# EAGLE design xbee_pro_sx_breakout_1 (EAGLE 9.6.2)
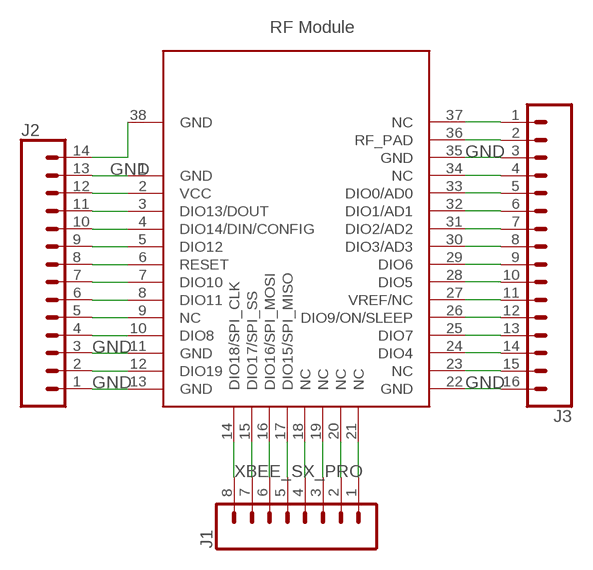
[diagram p0: schematic, sheet 1]

## Parts
J1  CONN_08"  [1X08]
J2  CONN_14  [1X14]
J3  CONN_16  [1X16]
U$1  XBEE_SX_PRO  [XBEE_SX_PRO]

## Nets
GND: J2.1 J2.3 J2.13 J2.14 J3.3 J3.16 U$1.1(GND) U$1.11(GND) U$1.13(GND) U$1.22(GND) U$1.35(GND) U$1.38(GND)
N$1: J3.1 U$1.37(NC)
N$2: J3.2 U$1.36(RF_PAD)
N$4: J3.4 U$1.34(NC)
N$5: J3.5 U$1.33(DIO0/AD0)
N$6: J3.6 U$1.32(DIO1/AD1)
N$7: J3.7 U$1.31(DIO2/AD2)
N$8: J3.8 U$1.30(DIO3/AD3)
N$9: J3.9 U$1.29(DIO6)
N$10: J3.10 U$1.28(DIO5)
N$11: J3.11 U$1.27(VREF/NC)
N$12: J3.12 U$1.26(DIO9/ON/SLEEP)
N$13: J3.13 U$1.25(DIO7)
N$14: J3.14 U$1.24(DIO4)
N$15: J3.15 U$1.23(NC)
N$17: J1.1 U$1.21(NC)
N$18: J1.2 U$1.20(NC)
N$19: J1.3 U$1.19(NC)
N$20: J1.4 U$1.18(NC)
N$21: J1.5 U$1.17(DIO15/SPI_MISO)
N$22: J1.6 U$1.16(DIO16/SPI_MOSI)
N$23: J1.7 U$1.15(DIO17/SPI_SS)
N$24: J1.8 U$1.14(DIO18/SPI_CLK)
N$26: J2.2 U$1.12(DIO19)
N$28: J2.4 U$1.10(DIO8)
N$29: J2.5 U$1.9(NC)
N$30: J2.6 U$1.8(DIO11)
N$31: J2.7 U$1.7(DIO10)
N$32: J2.8 U$1.6(RESET)
N$33: J2.9 U$1.5(DIO12)
N$34: J2.10 U$1.4(DIO14/DIN/CONFIG)
N$35: J2.11 U$1.3(DIO13/DOUT)
VCC: J2.12 U$1.2(VCC)

## Library data of the parts
J1 = SparkFun-Connectors:CONN_08: Multi connection point. Often used as Generic Header-pin footprint for 0.1 inch spaced/style header connections On any of the 0.1 inch spaced packages, you can populate with these: Break Away Headers - Straight <https://www.sparkfun.com/products/116> (PRT-00116) Break Away Male Headers - Right Angle <https://www.sparkfun.com/products/553> (PRT-00553) Female Headers <https://www.sparkfun.com/products/115> (PRT-00115) Break Away Headers - Machine Pin <https://www.sparkfun.com/products/117> (PRT-00117) Break Away Female Headers - Swiss Machine Pin <https://www.sparkfun.com/products/743> (PRT-00743) Arduino Stackable Header - 8 Pin <https://www.sparkfun.com/products/9279> (PRT-09279) For SCREWTERMINALS and SPRING TERMINALS visit here: Screw Terimnals on SparkFun.com <https://www.sparkfun.com/search/results?term=Screw+Terminals> (5mm/3.5mm/2.54mm spacing) This device is also useful as a general connection point to wire up your design to another part of your project. Our various solder wires solder well into these plated through hole pads. Hook-Up Wire - Assortment (Stranded, 22 AWG) <https://www.sparkfun.com/products/11375> (PRT-11375) Hook-Up Wire - Assortment (Solid Core, 22 AWG) <https://www.sparkfun.com/products/11367> (PRT-11367) View the entire wire category on our website here <https://www.sparkfun.com/categories/141> Special notes: Molex polarized connector foot print use with SKU : PRT-08231 with associated crimp pins and housings. 1MM SMD Version SKU: PRT-10208 NOTES ON THE VARIANTS LOCK and LOCK_LONGPADS... This footprint was designed to help hold the alignment of a through-hole component (i.e. 6-pin header) while soldering it into place. You may notice that each hole has been shifted either up or down by 0.005 of an inch from it's more standard position (which is a perfectly straight line). This slight alteration caused the pins (the squares in the middle) to touch the edges of the holes. Because they are alternating, it causes a "brace" to hold the component in place. 0.005 has proven to be the perfect amount of "off-center" position when using our standard breakaway headers. Although looks a little odd when you look at the bare footprint, once you have a header in there, the alteration is very hard to notice. Also,if you push a header all the way into place, it is covered up entirely on the bottom side.; PROD_ID: CONN-08438
J2 = SparkFun-Connectors:CONN_14: Multi connection point. Often used as Generic Header-pin footprint for 0.1 inch spaced/style header connections On any of the 0.1 inch spaced packages, you can populate with these: Break Away Headers - Straight <https://www.sparkfun.com/products/116> (PRT-00116) Break Away Male Headers - Right Angle <https://www.sparkfun.com/products/553> (PRT-00553) Female Headers <https://www.sparkfun.com/products/115> (PRT-00115) Break Away Headers - Machine Pin <https://www.sparkfun.com/products/117> (PRT-00117) Break Away Female Headers - Swiss Machine Pin <https://www.sparkfun.com/products/743> (PRT-00743) For SCREWTERMINALS and SPRING TERMINALS visit here: Screw Terimnals on SparkFun.com <https://www.sparkfun.com/search/results?term=Screw+Terminals> (5mm/3.5mm/2.54mm spacing) This device is also useful as a general connection point to wire up your design to another part of your project. Our various solder wires solder well into these plated through hole pads. Hook-Up Wire - Assortment (Stranded, 22 AWG) <https://www.sparkfun.com/products/11375> (PRT-11375) Hook-Up Wire - Assortment (Solid Core, 22 AWG) <https://www.sparkfun.com/products/11367> (PRT-11367) View the entire wire category on our website here <https://www.sparkfun.com/categories/141> Special notes: Molex polarized connector foot print use with SKU : PRT-08231 with associated crimp pins and housings. 1MM SMD Version SKU: PRT-10208 NOTES ON THE VARIANTS LOCK and LOCK_LONGPADS... This footprint was designed to help hold the alignment of a through-hole component (i.e. 6-pin header) while soldering it into place. You may notice that each hole has been shifted either up or down by 0.005 of an inch from it's more standard position (which is a perfectly straight line). This slight alteration caused the pins (the squares in the middle) to touch the edges of the holes. Because they are alternating, it causes a "brace" to hold the component in place. 0.005 has proven to be the perfect amount of "off-center" position when using our standard breakaway headers. Although looks a little odd when you look at the bare footprint, once you have a header in there, the alteration is very hard to notice. Also,if you push a header all the way into place, it is covered up entirely on the bottom side.
J3 = SparkFun-Connectors:CONN_16: Multi connection point. Often used as Generic Header-pin footprint for 0.1 inch spaced/style header connections On any of the 0.1 inch spaced packages, you can populate with these: Break Away Headers - Straight <https://www.sparkfun.com/products/116> (PRT-00116) Break Away Male Headers - Right Angle <https://www.sparkfun.com/products/553> (PRT-00553) Female Headers <https://www.sparkfun.com/products/115> (PRT-00115) Break Away Headers - Machine Pin <https://www.sparkfun.com/products/117> (PRT-00117) Break Away Female Headers - Swiss Machine Pin <https://www.sparkfun.com/products/743> (PRT-00743) For SCREWTERMINALS and SPRING TERMINALS visit here: Screw Terimnals on SparkFun.com <https://www.sparkfun.com/search/results?term=Screw+Terminals> (5mm/3.5mm/2.54mm spacing) This device is also useful as a general connection point to wire up your design to another part of your project. Our various solder wires solder well into these plated through hole pads. Hook-Up Wire - Assortment (Stranded, 22 AWG) <https://www.sparkfun.com/products/11375> (PRT-11375) Hook-Up Wire - Assortment (Solid Core, 22 AWG) <https://www.sparkfun.com/products/11367> (PRT-11367) View the entire wire category on our website here <https://www.sparkfun.com/categories/141> Special notes: Molex polarized connector foot print use with SKU : PRT-08231 with associated crimp pins and housings. 1MM SMD Version SKU: PRT-10208 NOTES ON THE VARIANTS LOCK and LOCK_LONGPADS... This footprint was designed to help hold the alignment of a through-hole component (i.e. 6-pin header) while soldering it into place. You may notice that each hole has been shifted either up or down by 0.005 of an inch from it's more standard position (which is a perfectly straight line). This slight alteration caused the pins (the squares in the middle) to touch the edges of the holes. Because they are alternating, it causes a "brace" to hold the component in place. 0.005 has proven to be the perfect amount of "off-center" position when using our standard breakaway headers. Although looks a little odd when you look at the bare footprint, once you have a header in there, the alteration is very hard to notice. Also,if you push a header all the way into place, it is covered up entirely on the bottom side.
U$1 = xbee_sx_pro:XBEE_SX_PRO

## Module BREAKOUT
Ports: 

### Library data of the parts

## Board
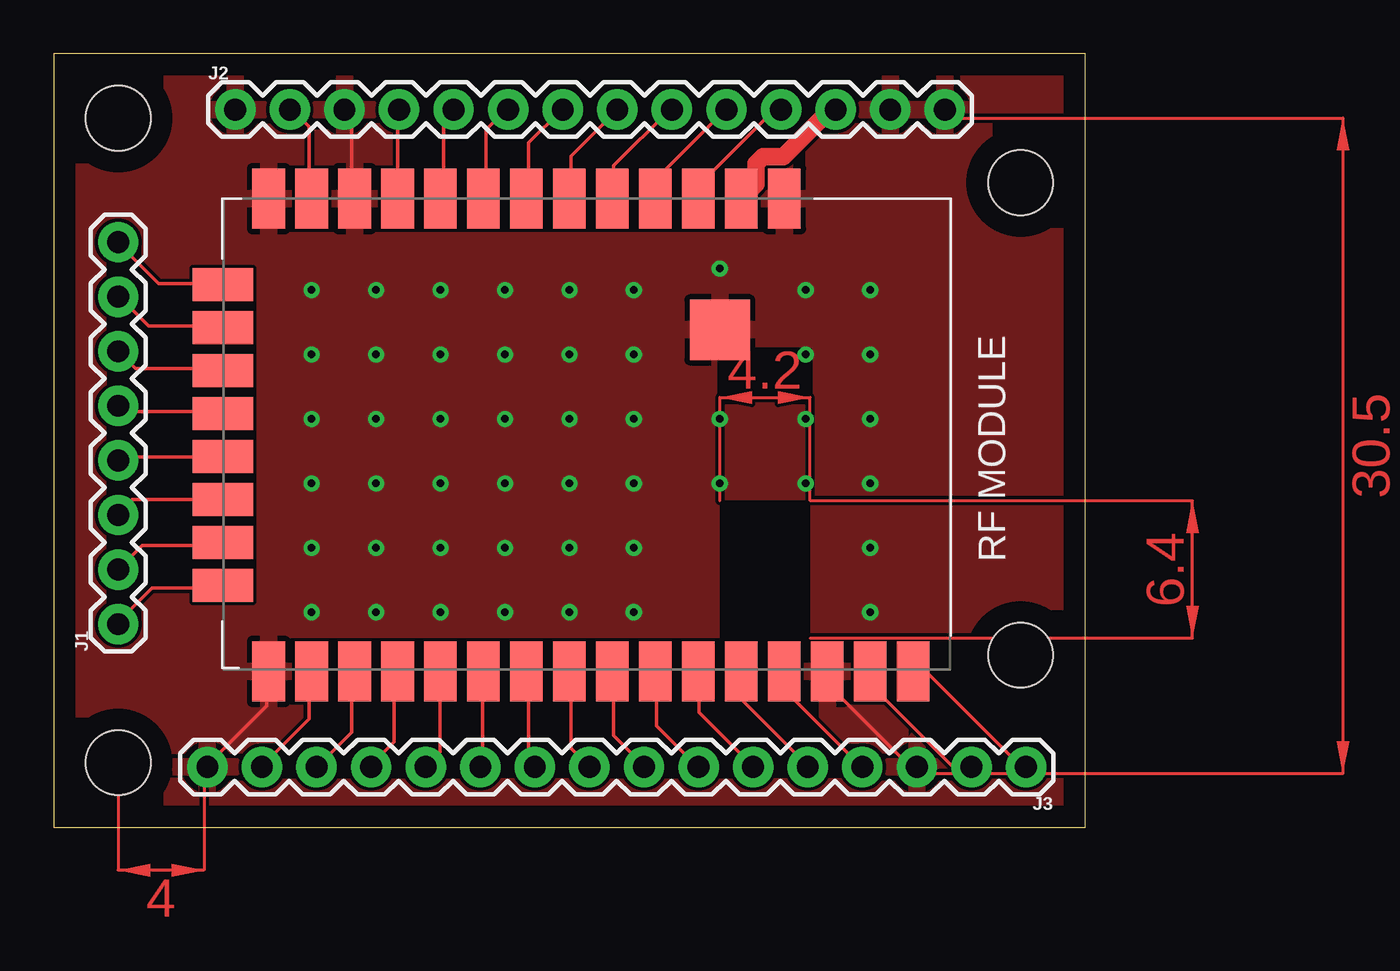
[diagram p1: board, top side]
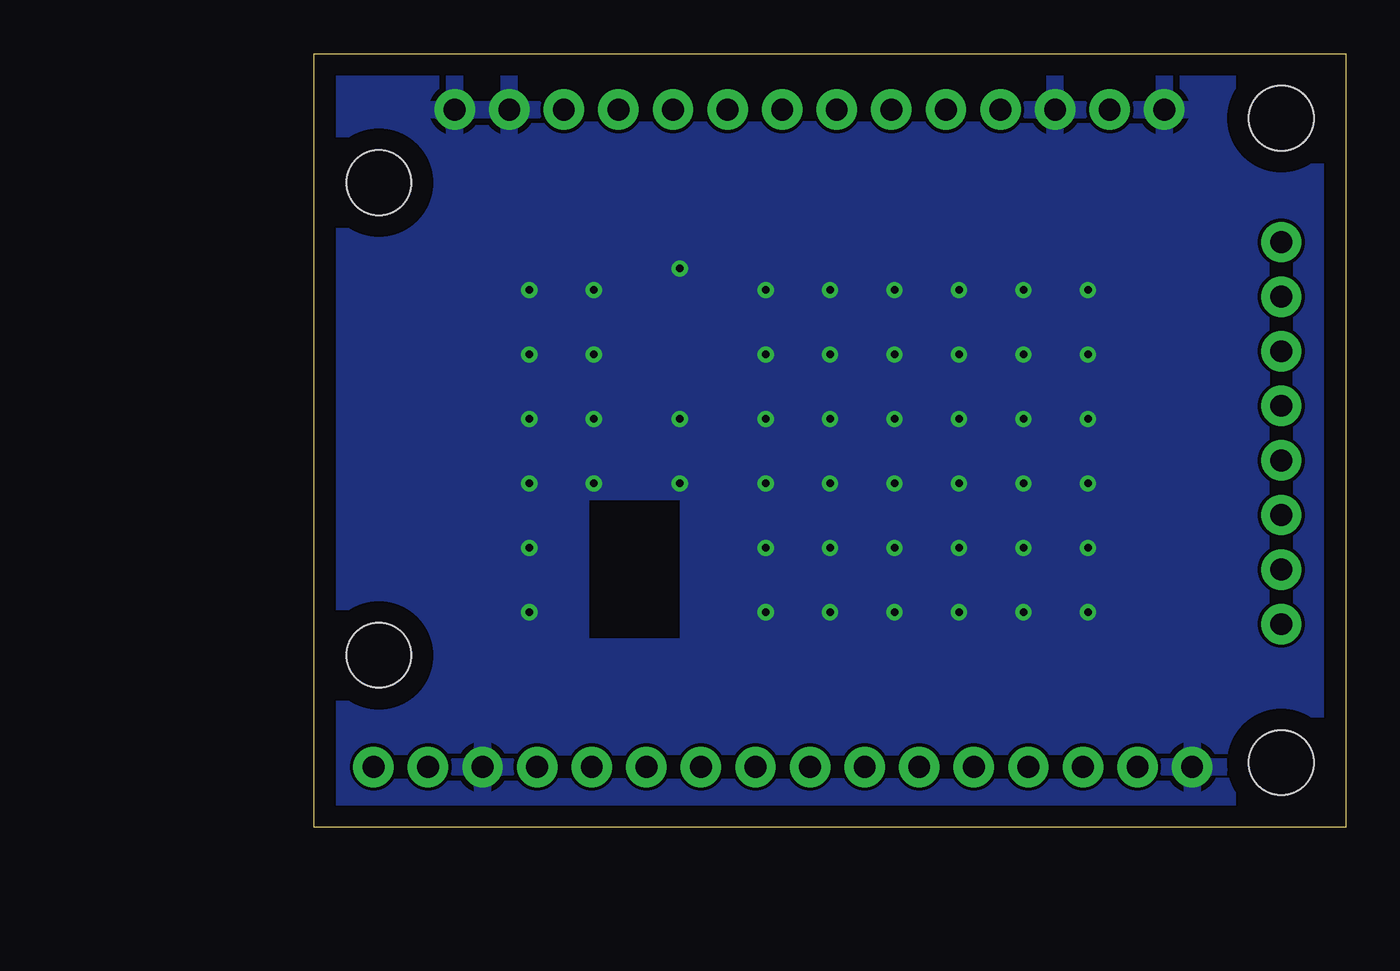
[diagram p2: board, bottom side, seen from below]

Size 48 x 36 mm. Coordinates in mm from the lower left corner, seen from the top.
Outline: 0,0 48,0 48,36 0,36 0,0
Copper layers (1*16): Top 0.035mm / dielectric 1.5mm / Bottom 0.035mm
Design rules "default": minimum track width 6mil, minimum drill 0.35mm, track to track 6mil, track to pad 6mil, pad to pad 6mil, via to via 6mil, smd to smd 6mil, copper to edge 40mil, drill to drill 6mil, minimum pad ring 10mil, minimum via ring 8mil, stop-mask expansion 4mil, vias tented up to drill 0mil, thermal gap 10mil
Holes 3 mm at 3,33 3,3 45,30 45,8
tKeepout: area 31,8.8 to 35.2,15.2
bKeepout: area 31,8.8 to 35.2,15.2
tRestrict: area 31,8.8 to 35.2,15.2
bRestrict: area 31,8.8 to 35.2,15.2

### Footprints (pad centres in the part's own frame; a part is rotated, then mirrored left to right if it is on the bottom)
1X08 = drill 1.016 pad 1.88: 1 0,0; 2 2.54,0; 3 5.08,0; 4 7.62,0; 5 10.16,0; 6 12.7,0; 7 15.24,0; 8 17.78,0
1X14 = drill 1.016 pad 1.88: 1 0,0; 2 2.54,0; 3 5.08,0; 4 7.62,0; 5 10.16,0; 6 12.7,0; 7 15.24,0; 8 17.78,0; 9 20.32,0; 10 22.86,0; 11 25.4,0; 12 27.94,0; 13 30.48,0; 14 33.02,0
1X16 = drill 1.016 pad 1.88: 1 0,0; 2 2.54,0; 3 5.08,0; 4 7.62,0; 5 10.16,0; 6 12.7,0; 7 15.24,0; 8 17.78,0; 9 20.32,0; 10 22.86,0; 11 25.4,0; 12 27.94,0; 13 30.48,0; 14 33.02,0; 15 35.56,0; 16 38.1,0
XBEE_SX_PRO = smd 2.8 x 1.52: 1 0,24; 2 0,22; 3 0,20; 4 0,18; 5 0,16; 6 0,14; 7 0,12; 8 0,10; 9 0,8; 10 0,6; 11 0,4; 12 0,2; 13 0,0; 22 22,0; 23 22,2; 24 22,4; 25 22,6; 26 22,8; 27 22,10; 28 22,12; 29 22,14; 30 22,16; 31 22,18; 32 22,20; 33 22,22; 34 22,24; 35 22,26; 36 22,28; 37 22,30 | smd 1.52 x 2.8: 14 4,-2.127; 15 6,-2.127; 16 8,-2.127; 17 10,-2.127; 18 12,-2.127; 19 14,-2.127; 20 16,-2.127; 21 18,-2.127 | smd 2.8 x 2.8: 38 6.1,21

### Placement (x,y rotation side)
J1  3,9.45 90 top
J2  8.45,33.4 0 top
J3  45.25,2.8 180 top
U$1  10,29.25 270 top

### Tracks (layer width: path | path; a pad name or v marks a point on that pad's centre or on a via)
GND  (via drill 0.35)
  Top 0.152: 31.09,23.16 U$1.38 | 41.45,33.53 J2.14 | 9.91,29.26 U$1.13 | 8.53,33.38 J2.1 | 34.25,29.26 34.14,29.26 U$1.1 | U$1.22 9.91,7.16 9.91,5.64 7.16,2.9 J3.16 | U$1.35 36.12,7.16 36.12,6.55 39.78,2.9 40.08,2.9 J3.3 | U$1.11 13.87,29.26 13.87,33.07 13.56,33.38 J2.3
  other vias: 12,25 27,10 15,10 15,25 18,25 21,25 24,25 27,25 31,26 35,25 38,25 38,22 35,22 27,22 24,22 21,22 18,22 15,22 12,22 12,19 15,19 18,19 21,19 24,19 27,19 31,19 35,19 38,19 12,16 15,16 18,16 21,16 24,16 27,16 31,16 35,16 38,16 38,13 38,10 27,13 24,13 21,13 24,10 21,10 18,10 18,13 15,13 12,13 12,10
  pour Top: 0,36 48,36 48,0 0,0
  pour Bottom: 0,36 48,36 48,0 0,0
N$1
  Top 0.152: U$1.37 40.08,7.16 40.69,7.16 45.11,2.74 J3.1
N$2
  Top 0.152: U$1.36 38.1,7.16 38.1,6.55 41.76,2.9 42.67,2.9 J3.2
N$4
  Top 0.152: U$1.34 34.14,7.16 34.14,6.25 37.49,2.9 J3.4
N$5
  Top 0.152: U$1.33 32,7.16 32,5.94 35.05,2.9 J3.5
N$6
  Top 0.152: U$1.32 30.02,7.16 30.02,5.33 32.46,2.9 J3.6
N$7
  Top 0.152: U$1.31 28.04,7.16 28.04,4.72 29.87,2.9 J3.7
N$8
  Top 0.152: U$1.30 26.06,7.16 26.06,4.27 27.43,2.9 J3.8
N$9
  Top 0.152: U$1.29 24.08,7.16 24.08,3.66 24.84,2.9 J3.9
N$10
  Top 0.152: U$1.28 22.1,7.16 22.1,3.05 22.25,2.9 J3.10
N$11
  Top 0.152: U$1.27 19.96,7.16 19.96,2.9 J3.11
N$12
  Top 0.152: U$1.26 17.98,7.16 17.98,3.5 17.37,2.9 J3.12
N$13
  Top 0.152: U$1.25 15.85,7.16 15.85,3.96 14.78,2.9 J3.13
N$14
  Top 0.152: U$1.24 13.87,7.16 13.87,4.42 12.34,2.9 J3.14
N$15
  Top 0.152: U$1.23 11.89,7.16 11.89,5.03 9.75,2.9 J3.15
N$17
  Top 0.152: U$1.21 7.77,11.12 4.57,11.12 3.05,9.6 J1.1
N$18
  Top 0.152: U$1.20 7.77,13.11 4.12,13.11 3.05,12.04 J1.2
N$19
  Top 0.152: U$1.19 7.77,15.24 3.66,15.24 3.05,14.63 J1.3
N$20
  Top 0.152: U$1.18 7.77,17.22 3.05,17.22 J1.4
N$21
  Top 0.152: U$1.17 7.77,19.36 3.2,19.36 3.05,19.51 J1.5
N$22
  Top 0.152: U$1.16 7.77,21.34 3.81,21.34 3.05,22.1 J1.6
N$23
  Top 0.152: U$1.15 7.77,23.32 4.42,23.32 3.05,24.69 J1.7
N$24
  Top 0.152: U$1.14 7.77,25.3 4.88,25.3 3.05,27.13 J1.8
N$26
  Top 0.152: U$1.12 11.89,29.26 11.89,32.61 11.12,33.38 J2.2
N$28
  Top 0.152: U$1.10 16,33.38 J2.4
N$29
  Top 0.152: U$1.9 18.14,29.26 18.14,32.92 18.59,33.38 J2.5
N$30
  Top 0.152: U$1.8 20.12,29.26 20.12,32.46 21.03,33.38 J2.6
N$31
  Top 0.152: U$1.7 22.1,29.26 22.1,31.85 23.62,33.38 J2.7
N$32
  Top 0.152: U$1.6 24.08,29.26 24.08,31.24 26.21,33.38 J2.8
N$33
  Top 0.152: U$1.5 26.06,29.26 26.06,30.79 28.65,33.38 J2.9
N$34
  Top 0.152: U$1.4 28.04,29.26 28.04,30.18 31.24,33.38 J2.10
N$35
  Top 0.152: U$1.3 30.02,29.26 30.02,29.87 33.53,33.38 33.83,33.38 J2.11
VCC
  Top 0.152: 32,29.87 U$1.2 | 35.51,33.38 36.27,33.38 J2.12
  Top 0.813: 36.27,33.38 36.13,33.38 33.96,31.21 33.01,31.21 32.68,30.88 32.68,29.93 U$1.2
(copper drawn outside any net)
  shapes: Top area x4